# Altium schematic sheet PowerFull_car_engineSteering.SchDoc
size A4
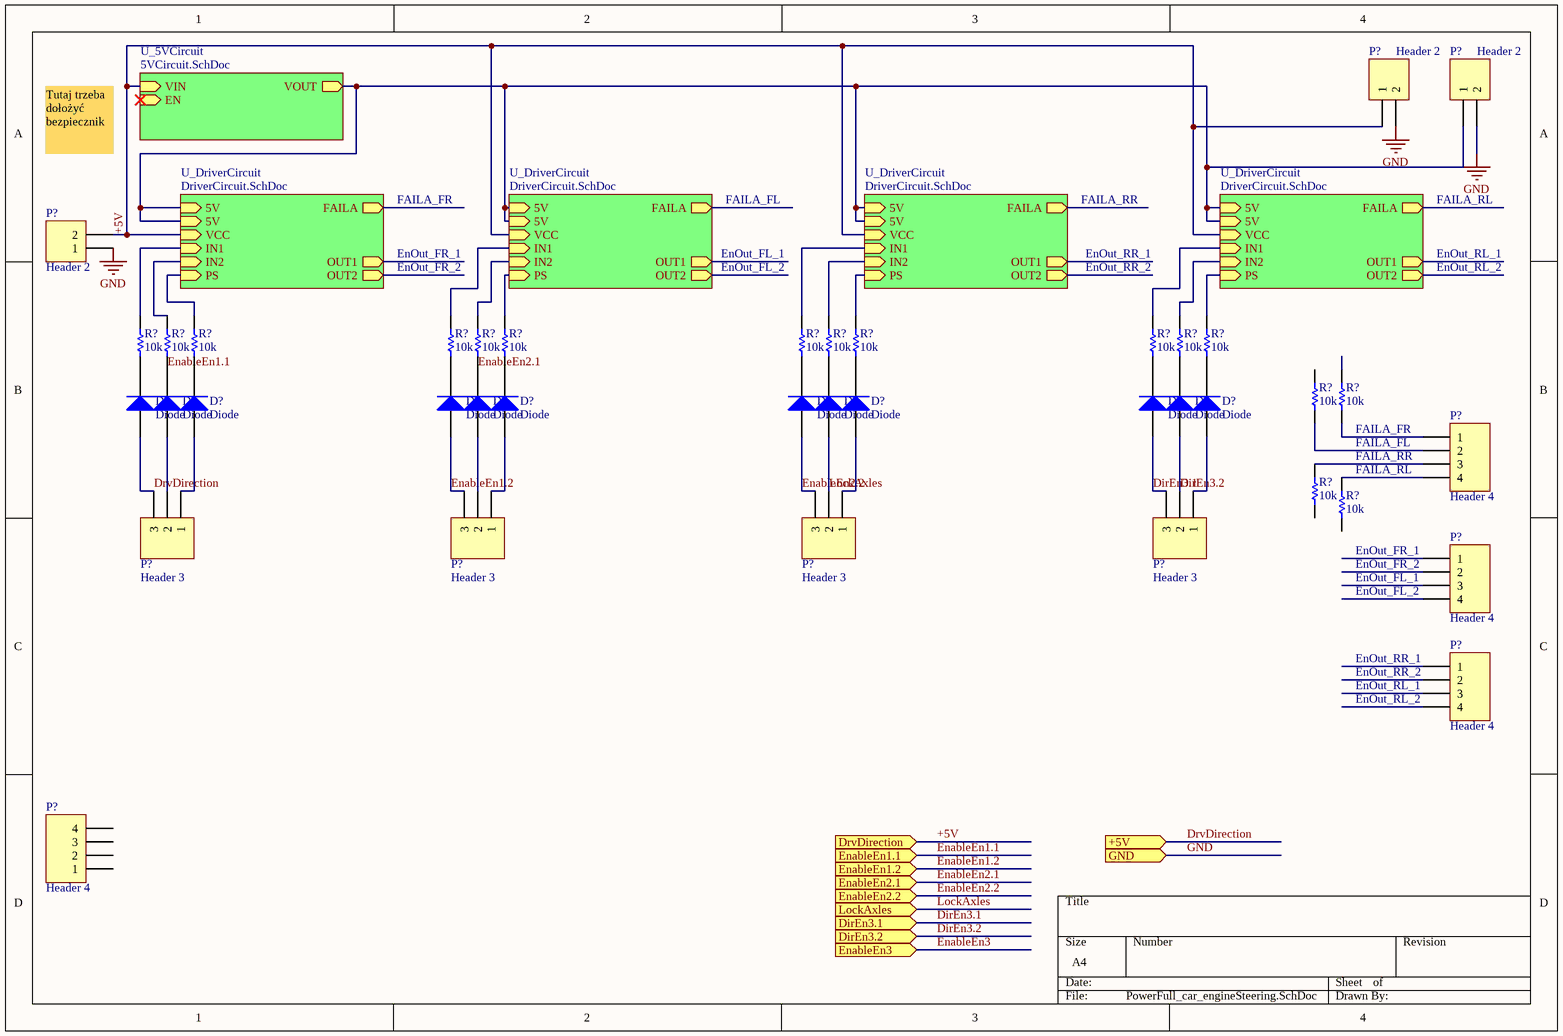
[diagram p0: PowerFull_car_engineSteering.SchDoc]

## Parts
(Parts that share a designator on the sheet are numbered #1, #2 ... from top to bottom, then left to right.)
D?#1  Diode  [SMC]
D?#2  Diode  [SMC]
D?#3  Diode  [SMC]
D?#4  Diode  [SMC]
D?#5  Diode  [SMC]
D?#6  Diode  [SMC]
D?#7  Diode  [SMC]
D?#8  Diode  [SMC]
D?#9  Diode  [SMC]
D?#10  Diode  [SMC]
D?#11  Diode  [SMC]
D?#12  Diode  [SMC]
P?#1  Header 2  [HDR1X2]
P?#2  Header 2  [HDR1X2]
P?#3  Header 2  [HDR1X2]
P?#4  Header 4  [HDR1X4]
P?#5  Header 3  [HDR1X3]
P?#6  Header 3  [HDR1X3]
P?#7  Header 3  [HDR1X3]
P?#8  Header 3  [HDR1X3]
P?#9  Header 4  [HDR1X4]
P?#10  Header 4  [HDR1X4]
P?#11  Header 4  [HDR1X4]
R?#1  value 10k  [0603]  (hidden comment: Res1)
R?#2  value 10k  [0603]  (hidden comment: Res1)
R?#3  value 10k  [0603]  (hidden comment: Res1)
R?#4  value 10k  [0603]  (hidden comment: Res1)
R?#5  value 10k  [0603]  (hidden comment: Res1)
R?#6  value 10k  [0603]  (hidden comment: Res1)
R?#7  value 10k  [0603]  (hidden comment: Res1)
R?#8  value 10k  [0603]  (hidden comment: Res1)
R?#9  value 10k  [0603]  (hidden comment: Res1)
R?#10  value 10k  [0603]  (hidden comment: Res1)
R?#11  value 10k  [0603]  (hidden comment: Res1)
R?#12  value 10k  [0603]  (hidden comment: Res1)
R?#13  value 10k  [0603]  (hidden comment: Res1)
R?#14  value 10k  [0603]  (hidden comment: Res1)
R?#15  value 10k  [0603]  (hidden comment: Res1)
R?#16  value 10k  [0603]  (hidden comment: Res1)

## Sub-sheets
U_5VCircuit = 5VCircuit.SchDoc: VIN (in), EN (in), VOUT (out)
U_DriverCircuit = DriverCircuit.SchDoc: 5V (in), FAILA (out), PS (in), VCC (in), OUT1 (out), OUT2 (out), IN1 (in), 5V (in), IN2 (in)
U_DriverCircuit = DriverCircuit.SchDoc: 5V (in), FAILA (out), PS (in), VCC (in), OUT1 (out), OUT2 (out), IN1 (in), 5V (in), IN2 (in)
U_DriverCircuit = DriverCircuit.SchDoc: 5V (in), FAILA (out), PS (in), VCC (in), OUT1 (out), OUT2 (out), IN1 (in), 5V (in), IN2 (in)
U_DriverCircuit = DriverCircuit.SchDoc: 5V (in), FAILA (out), PS (in), VCC (in), OUT1 (out), OUT2 (out), IN1 (in), 5V (in), IN2 (in)

## Ports
+5V (in), DirEn3.1 (in), DirEn3.2 (in), DrvDirection (in), EnableEn1.1 (in), EnableEn1.2 (in), EnableEn2.1 (in), EnableEn2.2 (in), EnableEn3 (in), GND (in), LockAxles (in)

## Nets
GND: P?#1.2 P?#2.2 P?#3.1 ; port GND
+5V: P?#1.1 P?#3.2 ; port DrvDirection, sheet U_DriverCircuit/VCC, sheet U_5VCircuit/VIN, sheet U_DriverCircuit/VCC, sheet U_DriverCircuit/VCC, sheet U_DriverCircuit/VCC
DirEn3.1: D?#10.1(A) P?#8.3 ; port DirEn3.1
DirEn3.2: D?#11.1(A) P?#8.2 ; port DirEn3.2
DrvDirection: D?#1.1(A) P?#5.3 ; port +5V
EnableEn1.1: D?#2.2(K) R?#2.1 ; port EnableEn1.1
EnableEn1.2: D?#4.1(A) P?#6.3 ; port EnableEn1.2
EnableEn2.1: D?#5.2(K) R?#5.1 ; port EnableEn2.1
EnableEn2.2: D?#7.1(A) P?#7.3 ; port EnableEn2.2
EnableEn3: port EnableEn3
LockAxles: D?#8.1(A) P?#7.2 ; port LockAxles
NetD?#1_2: D?#1.2(K) R?#1.1
NetD?#2_1: D?#2.1(A) P?#5.2
NetD?#3_1: D?#3.1(A) P?#5.1
NetD?#3_2: D?#3.2(K) R?#3.1
NetD?#4_2: D?#4.2(K) R?#4.1
NetD?#5_1: D?#5.1(A) P?#6.2
NetD?#6_1: D?#6.1(A) P?#6.1
NetD?#6_2: D?#6.2(K) R?#6.1
NetD?#7_2: D?#7.2(K) R?#7.1
NetD?#8_2: D?#8.2(K) R?#8.1
NetD?#9_1: D?#9.1(A) P?#7.1
NetD?#9_2: D?#9.2(K) R?#9.1
NetD?#10_2: D?#10.2(K) R?#10.1
NetD?#11_2: D?#11.2(K) R?#11.1
NetD?#12_1: D?#12.1(A) P?#8.1
NetD?#12_2: D?#12.2(K) R?#12.1
NetP?#2_1: P?#2.1 ; sheet U_DriverCircuit/5V, sheet U_DriverCircuit/5V, sheet U_5VCircuit/VOUT, sheet U_DriverCircuit/5V, sheet U_DriverCircuit/5V, sheet U_DriverCircuit/5V, sheet U_DriverCircuit/5V, sheet U_DriverCircuit/5V, sheet U_DriverCircuit/5V
NetP?#4_1: P?#4.1 R?#14.1
NetP?#4_2: P?#4.2 R?#13.1
NetP?#4_3: P?#4.3 R?#15.2
NetP?#4_4: P?#4.4 R?#16.2
NetR?#1_2: R?#1.2 ; sheet U_DriverCircuit/IN1
NetR?#2_2: R?#2.2 ; sheet U_DriverCircuit/IN2
NetR?#3_2: R?#3.2 ; sheet U_DriverCircuit/PS
NetR?#4_2: R?#4.2 ; sheet U_DriverCircuit/IN1
NetR?#5_2: R?#5.2 ; sheet U_DriverCircuit/IN2
NetR?#6_2: R?#6.2 ; sheet U_DriverCircuit/PS
NetR?#7_2: R?#7.2 ; sheet U_DriverCircuit/IN1
NetR?#8_2: R?#8.2 ; sheet U_DriverCircuit/IN2
NetR?#9_2: R?#9.2 ; sheet U_DriverCircuit/PS
NetR?#10_2: R?#10.2 ; sheet U_DriverCircuit/IN1
NetR?#11_2: R?#11.2 ; sheet U_DriverCircuit/IN2
NetR?#12_2: R?#12.2 ; sheet U_DriverCircuit/PS

Not connected (* = marked no-connect by the designer): P?#9 1 2 3 4; P?#10 1 2 3 4; P?#11 1 2 3 4; R?#13 2; R?#14 2; R?#15 1; R?#16 1

## Notes on the sheet
- Tutaj trzeba dołożyć bezpiecznik
- FAILA_FR
- FAILA_FL
- FAILA_RR
- FAILA_RL
- EnOut_FR_1
- EnOut_FR_2
- EnOut_FL_1
- EnOut_FL_2
- EnOut_RR_1
- EnOut_RR_2
- EnOut_RL_1
- EnOut_RL_2
- (near R?#14) FAILA_FL
- (near R?#14) FAILA_FR
- (near R?#16) FAILA_RL
- (near R?#16) FAILA_RR
- (near P?#9) EnOut_FL_1
- (near P?#9) EnOut_FL_2
- (near P?#10) EnOut_RL_1
- (near P?#10) EnOut_RL_2
- (near P?#10) EnOut_RR_1
- (near P?#10) EnOut_RR_2

## Library data of the parts
D?#1-D?#12 = Diode: Default Diode; Published: 8-Jun-2000; LatestRevisionDate: 17-Jul-2002; LatestRevisionNote: Re-released for DXP Platform.; PackageVersion: Sep-1996; PackageReference: SMC; Publisher: Altium Limited; PackageDescription: DO-214-AB/SMC; 2 C-Bend Leads; Body 7.9 x 5.9 mm, inc. leads (LxW); Code_JEDEC: DO-214-AB
P?#1-P?#3 = Header 2: Header, 2-Pin; LatestRevisionDate: 17-Jul-2002; LatestRevisionNote: Re-released for DXP Platform.; Publisher: Altium Limited
P?#4 P?#9-P?#11 = Header 4: Header, 4-Pin; LatestRevisionDate: 17-Jul-2002; LatestRevisionNote: Re-released for DXP Platform.; Publisher: Altium Limited
P?#5-P?#8 = Header 3: Header, 3-Pin; LatestRevisionDate: 17-Jul-2002; LatestRevisionNote: Re-released for DXP Platform.; Publisher: Altium Limited
R?#1-R?#16 = Res1: Resistor; Published: 8-Jun-2000; LatestRevisionDate: 17-Jul-2002; LatestRevisionNote: Re-released for DXP Platform.; PackageReference: AXIAL-0.3; Publisher: Altium Limited; PackageDescription: Axial Device, Thru-Hole; 2 Leads; 0.3 in Pin Spacing